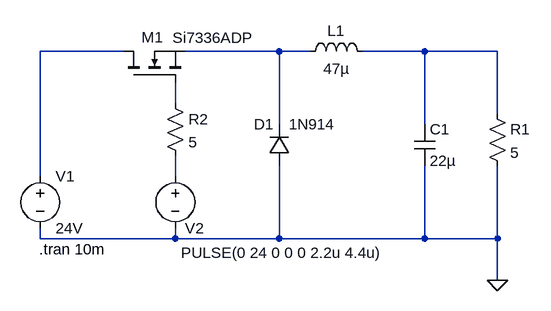
[diagram p0: schematic Draft2.asc]
Draft2.asc, the LTspice schematic file:
Version 4
SHEET 1 880 680
WIRE 160 -32 32 -32
WIRE 400 -32 256 -32
WIRE 448 -32 400 -32
WIRE 624 -32 528 -32
WIRE 736 -32 624 -32
WIRE 240 48 240 16
WIRE 736 64 736 -32
WIRE 400 80 400 -32
WIRE 624 80 624 -32
WIRE 32 160 32 -32
WIRE 240 160 240 128
WIRE 32 256 32 240
WIRE 240 256 240 240
WIRE 240 256 32 256
WIRE 400 256 400 144
WIRE 400 256 240 256
WIRE 624 256 624 144
WIRE 624 256 400 256
WIRE 736 256 736 144
WIRE 736 256 624 256
WIRE 736 320 736 256
FLAG 736 320 0
SYMBOL voltage 32 144 R0
WINDOW 123 0 0 Left 0
WINDOW 39 0 0 Left 0
SYMATTR InstName V1
SYMATTR Value 24V
SYMBOL diode 416 144 R180
WINDOW 0 24 64 Left 2
WINDOW 3 -70 64 Left 2
SYMATTR InstName D1
SYMATTR Value 1N914
SYMBOL ind 432 -16 R270
WINDOW 0 32 56 VTop 2
WINDOW 3 5 56 VBottom 2
SYMATTR InstName L1
SYMATTR Value 47µ
SYMATTR SpiceLine Ipk=1.1 Rser=0.29 Rpar=61.264 Cpar=3.195p mfg="Wth Elektronik" pn="784778470 WE-PDA 7332"
SYMBOL res 720 48 R0
SYMATTR InstName R1
SYMATTR Value 5
SYMBOL cap 608 80 R0
SYMATTR InstName C1
SYMATTR Value 22µ
SYMATTR SpiceLine V=20 Irms=2.2 Rser=0.0191932 Lser=2.99544n mfg="Wth Elektronik" pn="875105444003 WCAP-PSLP 6,3 x 5,8" type="Al polymer"
SYMBOL voltage 240 144 R0
WINDOW 0 15 96 Left 2
WINDOW 3 9 134 Left 2
WINDOW 123 0 0 Left 0
WINDOW 39 0 0 Left 0
SYMATTR InstName V2
SYMATTR Value PULSE(0 24 0 0 0 2.2u 4.4u)
SYMBOL res 224 32 R0
SYMATTR InstName R2
SYMATTR Value 5
SYMBOL nmos 160 16 R270
WINDOW 0 70 28 VRight 2
WINDOW 3 69 76 VRight 2
SYMATTR InstName M1
SYMATTR Value Si7336ADP
TEXT 30 272 Left 2 !.tran 10m

The netlist it stands for:
* Draft2.asc
V1 N001 0 24V
D1 0 N002 1N914
L1 N002 N003 47µ Ipk=1.1 Rser=0.29 Rpar=61.264 Cpar=3.195p mfg="Wth Elektronik" pn="784778470 WE-PDA 7332"
R1 N003 0 5
C1 N003 0 22µ V=20 Irms=2.2 Rser=0.0191932 Lser=2.99544n mfg="Wth Elektronik" pn="875105444003 WCAP-PSLP 6,3 x 5,8" type="Al polymer"
V2 N005 0 PULSE(0 24 0 0 0 2.2u 4.4u)
R2 N004 N005 5
M1 N001 N004 N002 N002 Si7336ADP
.model D D
.lib standard.dio
.model NMOS NMOS
.model PMOS PMOS
.lib standard.mos
.tran 10m
.backanno
.end